# Altium schematic sheet PS_Ethernet.SchDoc: PS_Ethernet
size A3; Author: Carlos Barreiro; Organization: Escuela Técnica Superior de Ingeniería de Sistemas Informáticos de la Universidad Politécnica de Madrid; Address1: Campus Sur de la Universidad Politécnica de Madrid; Address2: Calle de Alan Turing, s/nº; Address3: Madrid 28031; Address4: España; DocumentNumber: 14; Revision: A; SheetNumber: 14; SheetTotal: 16
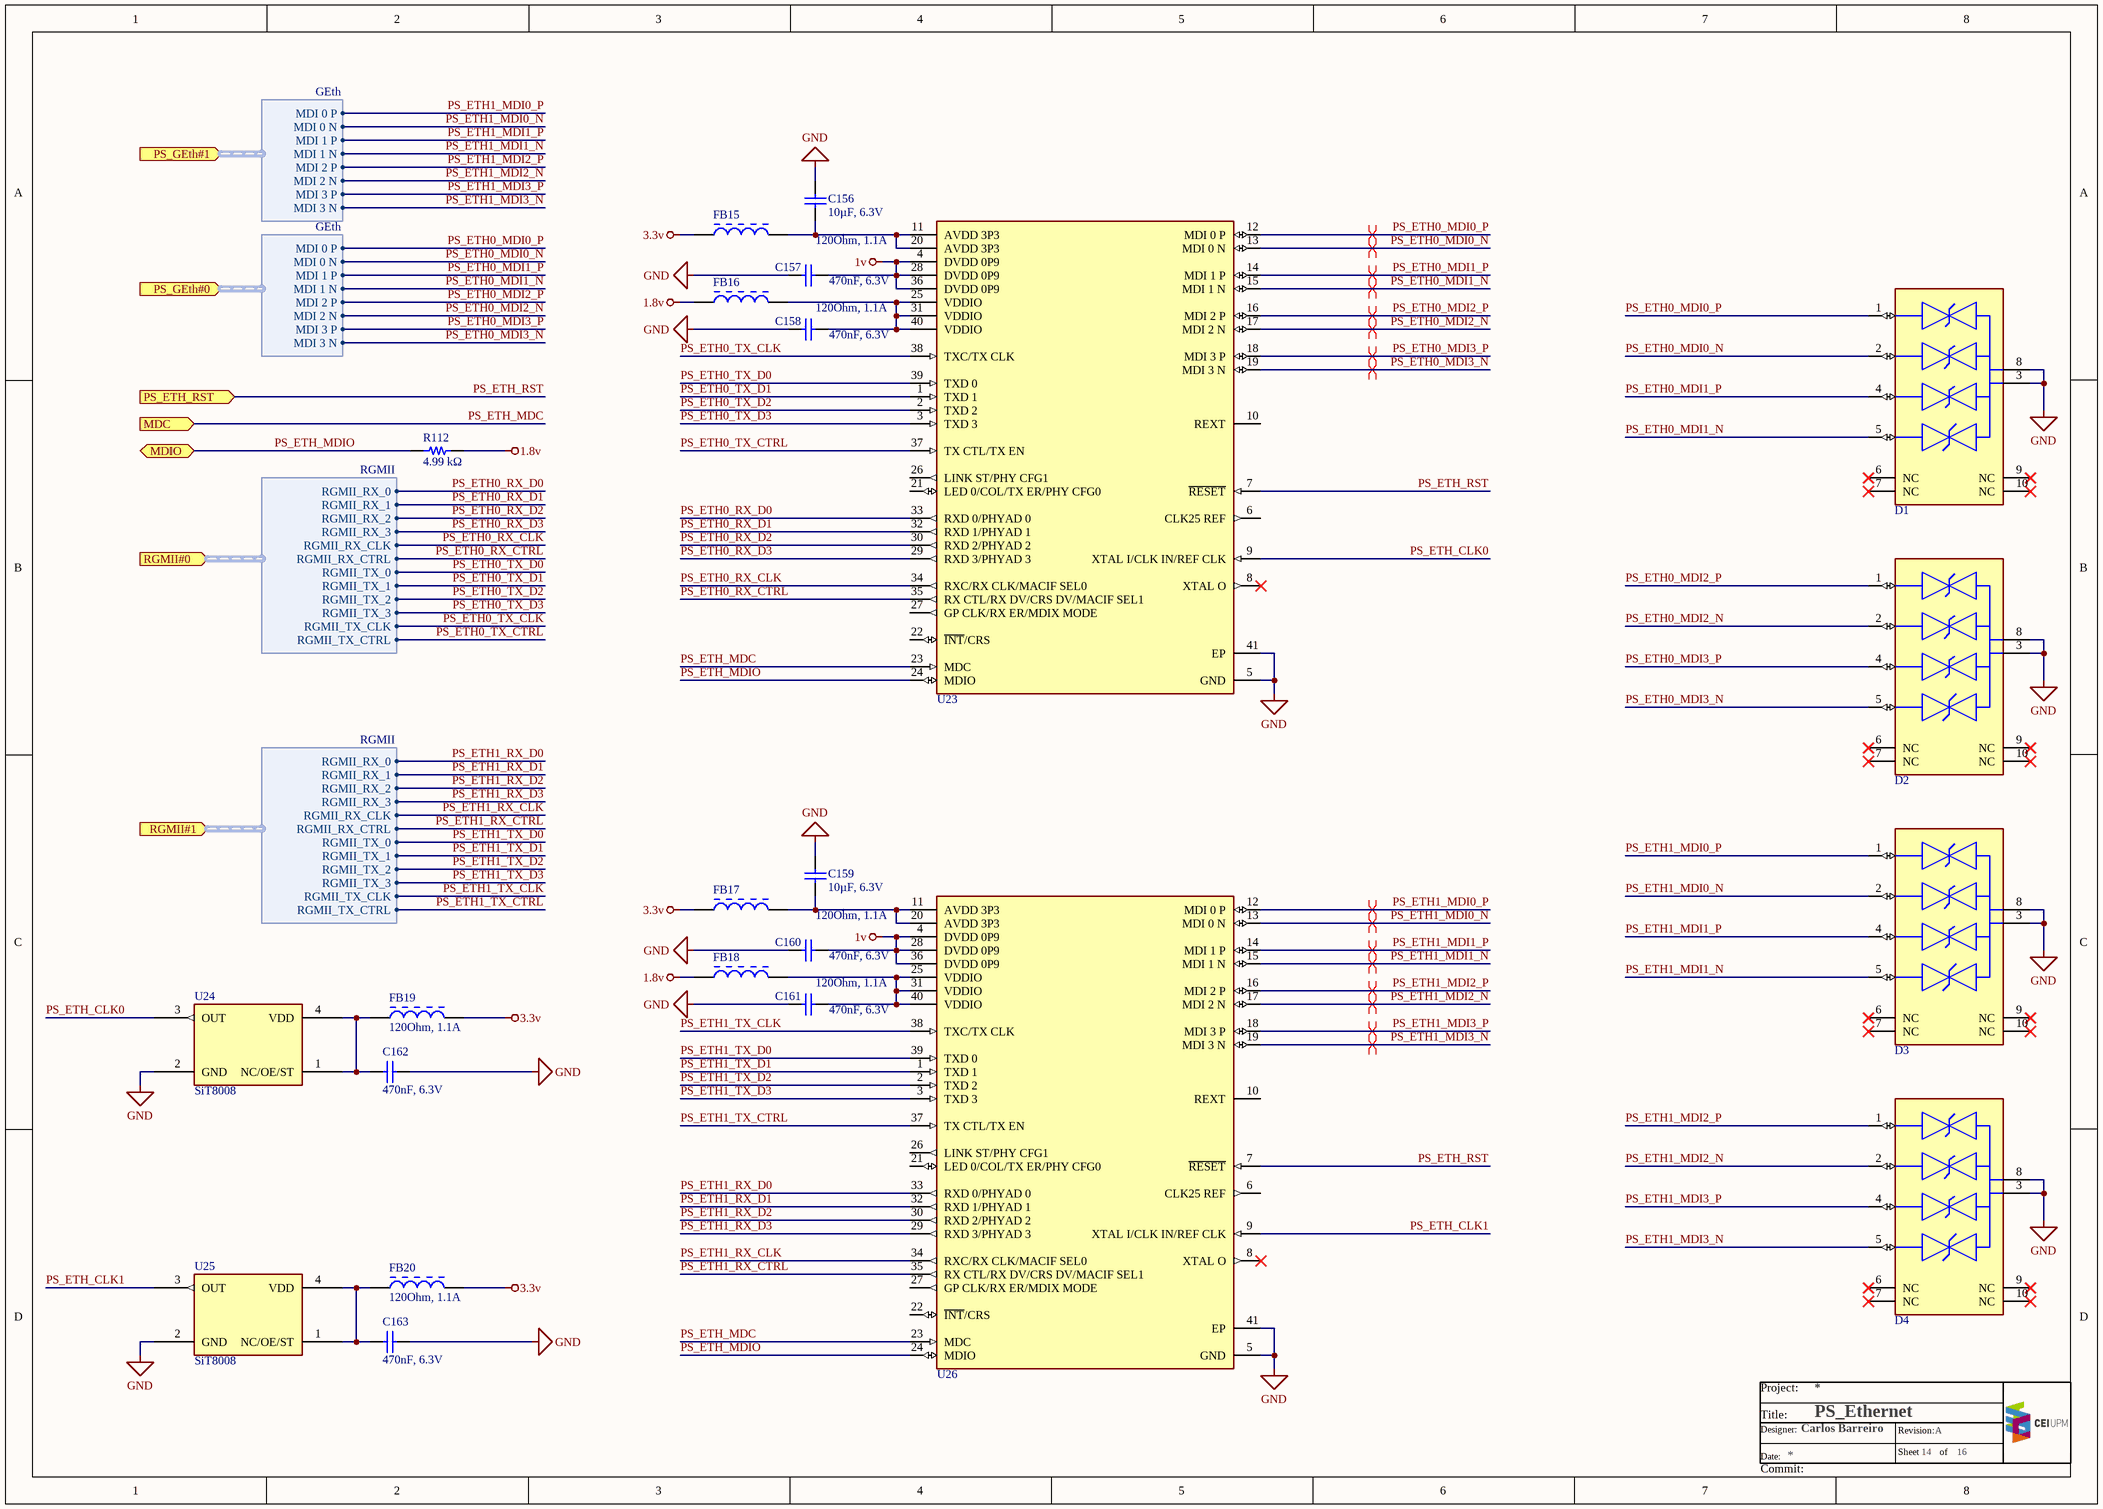
[diagram p0: PS_Ethernet.SchDoc]

## Parts
C156  10µF, 6.3V  [WURTH_WCAP-CSGP_0402]
C157  470nF, 6.3V  [WURTH_WCAP-CSGP_0402]
C158  470nF, 6.3V  [WURTH_WCAP-CSGP_0402]
C159  10µF, 6.3V  [WURTH_WCAP-CSGP_0402]
C160  470nF, 6.3V  [WURTH_WCAP-CSGP_0402]
C161  470nF, 6.3V  [WURTH_WCAP-CSGP_0402]
C162  470nF, 6.3V  [WURTH_WCAP-CSGP_0402]
C163  470nF, 6.3V  [WURTH_WCAP-CSGP_0402]
D1  ESD204DQAR  [TEXAS_USON10]  (value not drawn)
D2  ESD204DQAR  [TEXAS_USON10]  (value not drawn)
D3  ESD204DQAR  [TEXAS_USON10]  (value not drawn)
D4  ESD204DQAR  [TEXAS_USON10]  (value not drawn)
FB15  120Ohm, 1.1A  [WURTH-CBF_0402]
FB16  120Ohm, 1.1A  [WURTH-CBF_0402]
FB17  120Ohm, 1.1A  [WURTH-CBF_0402]
FB18  120Ohm, 1.1A  [WURTH-CBF_0402]
FB19  120Ohm, 1.1A  [WURTH-CBF_0402]
FB20  120Ohm, 1.1A  [WURTH-CBF_0402]
R112  4.99 kΩ  [PANASONIC_ERJ2G_0402]
U23  ADIN1300CCPZ  [ADI_LFCSP40]  (value not drawn)
U24  SiT8008  [SiTime_5032_4]
U25  SiT8008  [SiTime_5032_4]
U26  ADIN1300CCPZ  [ADI_LFCSP40]  (value not drawn)

## Ports
MDC (in), MDIO (bidir), PS_ETH_RST (in), PS_GEth#0 (in, harness GEth), PS_GEth#1 (in, harness GEth), RGMII#0 (in, harness RGMII), RGMII#1 (in, harness RGMII)

## Harnesses
RGMII: RGMII_RX_0, RGMII_RX_1, RGMII_RX_2, RGMII_RX_3, RGMII_RX_CLK, RGMII_RX_CTRL, RGMII_TX_0, RGMII_TX_1, RGMII_TX_2, RGMII_TX_3, RGMII_TX_CLK, RGMII_TX_CTRL
GEth: MDI 0 P, MDI 0 N, MDI 1 P, MDI 1 N, MDI 2 P, MDI 2 N, MDI 3 P, MDI 3 N

## Nets
1.8v: FB16.1 FB18.1 R112.2
1v: C157.2 C160.2 U23.4(DVDD_0P9) U23.28(DVDD_0P9) U23.36(DVDD_0P9) U26.4(DVDD_0P9) U26.28(DVDD_0P9) U26.36(DVDD_0P9)
3.3v: FB15.1 FB17.1 FB19.2 FB20.2
GND: C156.2 C157.1 C158.1 C159.2 C160.1 C161.1 C162.1 C163.1 D1.3(GND) D1.8(GND) D2.3(GND) D2.8(GND) D3.3(GND) D3.8(GND) D4.3(GND) D4.8(GND) U23.5(GND) U23.41(EP) U24.2(GND) U25.2(GND) U26.5(GND) U26.41(EP)
PS_ETH0_MDI0_N: D1.2(IO2) U23.13(MDI_0_N) ; port PS_GEth#0.MDI 0 N
PS_ETH0_MDI0_P: D1.1(IO1) U23.12(MDI_0_P) ; port PS_GEth#0.MDI 0 P
PS_ETH0_MDI1_N: D1.5(IO4) U23.15(MDI_1_N) ; port PS_GEth#0.MDI 1 N
PS_ETH0_MDI1_P: D1.4(IO3) U23.14(MDI_1_P) ; port PS_GEth#0.MDI 1 P
PS_ETH0_MDI2_N: D2.2(IO2) U23.17(MDI_2_N) ; port PS_GEth#0.MDI 2 N
PS_ETH0_MDI2_P: D2.1(IO1) U23.16(MDI_2_P) ; port PS_GEth#0.MDI 2 P
PS_ETH0_MDI3_N: D2.5(IO4) U23.19(MDI_3_N) ; port PS_GEth#0.MDI 3 N
PS_ETH0_MDI3_P: D2.4(IO3) U23.18(MDI_3_P) ; port PS_GEth#0.MDI 3 P
PS_ETH0_RX_CLK: U23.34(RXC/RX_CLK/MACIF_SEL0) ; port RGMII#0.RGMII_RX_CLK
PS_ETH0_RX_CTRL: U23.35(RX_CTL/RX_DV/CRS_DV/MACIF_SEL1) ; port RGMII#0.RGMII_RX_CTRL
PS_ETH0_RX_D0: U23.33(RXD_0/PHYAD_0) ; port RGMII#0.RGMII_RX_0
PS_ETH0_RX_D1: U23.32(RXD_1/PHYAD_1) ; port RGMII#0.RGMII_RX_1
PS_ETH0_RX_D2: U23.30(RXD_2/PHYAD_2) ; port RGMII#0.RGMII_RX_2
PS_ETH0_RX_D3: U23.29(RXD_3/PHYAD_3) ; port RGMII#0.RGMII_RX_3
PS_ETH0_TX_CLK: U23.38(TXC/TX_CLK) ; port RGMII#0.RGMII_TX_CLK
PS_ETH0_TX_CTRL: U23.37(TX_CTL/TX_EN) ; port RGMII#0.RGMII_TX_CTRL
PS_ETH0_TX_D0: U23.39(TXD_0) ; port RGMII#0.RGMII_TX_0
PS_ETH0_TX_D1: U23.1(TXD_1) ; port RGMII#0.RGMII_TX_1
PS_ETH0_TX_D2: U23.2(TXD_2) ; port RGMII#0.RGMII_TX_2
PS_ETH0_TX_D3: U23.3(TXD_3) ; port RGMII#0.RGMII_TX_3
PS_ETH1_MDI0_N: D3.2(IO2) U26.13(MDI_0_N) ; port PS_GEth#1.MDI 0 N
PS_ETH1_MDI0_P: D3.1(IO1) U26.12(MDI_0_P) ; port PS_GEth#1.MDI 0 P
PS_ETH1_MDI1_N: D3.5(IO4) U26.15(MDI_1_N) ; port PS_GEth#1.MDI 1 N
PS_ETH1_MDI1_P: D3.4(IO3) U26.14(MDI_1_P) ; port PS_GEth#1.MDI 1 P
PS_ETH1_MDI2_N: D4.2(IO2) U26.17(MDI_2_N) ; port PS_GEth#1.MDI 2 N
PS_ETH1_MDI2_P: D4.1(IO1) U26.16(MDI_2_P) ; port PS_GEth#1.MDI 2 P
PS_ETH1_MDI3_N: D4.5(IO4) U26.19(MDI_3_N) ; port PS_GEth#1.MDI 3 N
PS_ETH1_MDI3_P: D4.4(IO3) U26.18(MDI_3_P) ; port PS_GEth#1.MDI 3 P
PS_ETH1_RX_CLK: U26.34(RXC/RX_CLK/MACIF_SEL0) ; port RGMII#1.RGMII_RX_CLK
PS_ETH1_RX_CTRL: U26.35(RX_CTL/RX_DV/CRS_DV/MACIF_SEL1) ; port RGMII#1.RGMII_RX_CTRL
PS_ETH1_RX_D0: U26.33(RXD_0/PHYAD_0) ; port RGMII#1.RGMII_RX_0
PS_ETH1_RX_D1: U26.32(RXD_1/PHYAD_1) ; port RGMII#1.RGMII_RX_1
PS_ETH1_RX_D2: U26.30(RXD_2/PHYAD_2) ; port RGMII#1.RGMII_RX_2
PS_ETH1_RX_D3: U26.29(RXD_3/PHYAD_3) ; port RGMII#1.RGMII_RX_3
PS_ETH1_TX_CLK: U26.38(TXC/TX_CLK) ; port RGMII#1.RGMII_TX_CLK
PS_ETH1_TX_CTRL: U26.37(TX_CTL/TX_EN) ; port RGMII#1.RGMII_TX_CTRL
PS_ETH1_TX_D0: U26.39(TXD_0) ; port RGMII#1.RGMII_TX_0
PS_ETH1_TX_D1: U26.1(TXD_1) ; port RGMII#1.RGMII_TX_1
PS_ETH1_TX_D2: U26.2(TXD_2) ; port RGMII#1.RGMII_TX_2
PS_ETH1_TX_D3: U26.3(TXD_3) ; port RGMII#1.RGMII_TX_3
PS_ETH_CLK0: U23.9(XTAL_I/CLK_IN/REF_CLK) U24.3(OUT)
PS_ETH_CLK1: U25.3(OUT) U26.9(XTAL_I/CLK_IN/REF_CLK)
PS_ETH_MDC: U23.23(MDC) U26.23(MDC) ; port MDC
PS_ETH_MDIO: R112.1 U23.24(MDIO) U26.24(MDIO) ; port MDIO
PS_ETH_RST: U23.7(~{RESET}) U26.7(~{RESET}) ; port PS_ETH_RST
NetC156_1: C156.1 FB15.2 U23.11(AVDD_3P3) U23.20(AVDD_3P3)
NetC158_2: C158.2 FB16.2 U23.25(VDDIO) U23.31(VDDIO) U23.40(VDDIO)
NetC159_1: C159.1 FB17.2 U26.11(AVDD_3P3) U26.20(AVDD_3P3)
NetC161_2: C161.2 FB18.2 U26.25(VDDIO) U26.31(VDDIO) U26.40(VDDIO)
NetC162_2: C162.2 FB19.1 U24.1(NC/OE/ST) U24.4(VDD)
NetC163_2: C163.2 FB20.1 U25.1(NC/OE/ST) U25.4(VDD)

Not connected (* = marked no-connect by the designer): D1 6(NC)* 7(NC)* 9(NC)* 10(NC)*; D2 6(NC)* 7(NC)* 9(NC)* 10(NC)*; D3 6(NC)* 7(NC)* 9(NC)* 10(NC)*; D4 6(NC)* 7(NC)* 9(NC)* 10(NC)*; U23 6(CLK25_REF) 8(XTAL_O)* 10(REXT) 21(LED_0/COL/TX_ER/PHY_CFG0) 22(~{INT}/CRS) 26(LINK_ST/PHY_CFG1) 27(GP_CLK/RX_ER/MDIX_MODE); U26 6(CLK25_REF) 8(XTAL_O)* 10(REXT) 21(LED_0/COL/TX_ER/PHY_CFG0) 22(~{INT}/CRS) 26(LINK_ST/PHY_CFG1) 27(GP_CLK/RX_ER/MDIX_MODE)

## Layout directives
differential pair: PS_ETH0_MDI0_N, PS_ETH0_MDI0_P, PS_ETH0_MDI1_N, PS_ETH0_MDI1_P, PS_ETH0_MDI2_N, PS_ETH0_MDI2_P, PS_ETH0_MDI3_N, PS_ETH0_MDI3_P, PS_ETH1_MDI0_N, PS_ETH1_MDI0_P, PS_ETH1_MDI1_N, PS_ETH1_MDI1_P, PS_ETH1_MDI2_N, PS_ETH1_MDI2_P, PS_ETH1_MDI3_N, PS_ETH1_MDI3_P

## Notes on the sheet
- Project:
- Title:
- Date:
- Designer:
- Sheet
- Revision:
- of
- Commit:

## Library data of the parts
C156 C159 = 885012105020: WCAP-CSGP Multilayer Ceramic Chip Capacitor, General Purpose, size 0402, X5R, 10uF, 6.3V; Manufacturer: Wurth Elektronik; Rated Voltage: 6.3VDC; Isolation Resistance  min.: 0.01GOhm; Capacitance Tolerance: +/20%; Dissipation Factor max.: 10%; Technical Reference: X5R0402106M6R3DFCT10000; ComponentLink1Description: Manufacturer; ComponentLink1URL: http://www.we-online.de; ComponentLink2Description: Datasheet; ComponentLink2URL: https://www.we-online.com/catalog/datasheet/885012105020.pdf; Operating Temperature: -55 to +85degC; Packaging: Tape and Reel; Manufacturer Part Number: 885012105020; Published Date: April 2021; Ceramic Type: X5R; Height: 0.5mm; Mounting Technology: SMT; Size: 0402; Capacitance: 10uF; Q-Factor min.: -
C157 C158 C160-C163 = 885012105004: WCAP-CSGP Multilayer Ceramic Chip Capacitor, General Purpose, size 0402, X5R, 470nF, 6.3V; Manufacturer: Wurth Elektronik; Rated Voltage: 6.3VDC; Isolation Resistance  min.: 0.2GOhm; Capacitance Tolerance: +/-20%; Dissipation Factor max.: 10%; Technical Reference: X5R0402474M6R3DFCT10000; ComponentLink1Description: Manufacturer; ComponentLink1URL: http://www.we-online.de; ComponentLink2Description: Datasheet; ComponentLink2URL: https://www.we-online.com/catalog/datasheet/885012105004.pdf; Operating Temperature: -55 to +85degC; Packaging: Tape and Reel; Manufacturer Part Number: 885012105004; Published Date: April 2021; Ceramic Type: X5R; Height: 0.5mm; Mounting Technology: SMT; Size: 0402; Capacitance: 470nF; Supplier 1: Digi-Key; Supplier 2: Mouser; Supplier Part Number 1: 732-7481-1-ND; Supplier Part Number 2: 710-885012105004
D1-D4 = ESD204DQAR: ESD204 4-Channel Low-Capacitance Surge and ESD Protection Diode; Number of channels (#): 4; IO capacitance (Typ) (pF): 0.55; Vrwm (V): 3.6; Bi-/uni-directional: Bi-Directional; IO leakage current (Max) (nA): 10; Rating: Catalog; Dynamic resistance (Typ) (Ω): 0.3; Clamping voltage (V): 11.5; Operating temperature range (C): -40ºC to 125ºC; ComponentLink1Description: Manufacturer; ComponentLink1URL: https://www.ti.com/product/ESD204; Supplier 1: Digi-Key; Supplier 2: Mouser; Supplier Part Number 1: 296-49504-1-ND; Supplier Part Number 2: 595-ESD204DQAR
FB15-FB20 = 74279271: WE-CBF SMT EMI Suppression Ferrite Bead, size 0402, 120Ohm, 1.1A; Manufacturer: Wurth Elektronik; Impedance max.: 200Ohm; DC Resistance max.: 0.2Ohm; Type: Wide Band; ComponentLink1Description: Manufacturer; ComponentLink1URL: http://www.we-online.de; ComponentLink2Description: Datasheet; ComponentLink2URL: https://www.we-online.com/catalog/datasheet/74279271.pdf; Operating Temperature: -55 to +125degC; Packaging: Tape and Reel; Published Date: December 2021; Rated Current: 1.1A; Manufacturer Part Number: 74279271; Impedance @100MHz: 120Ohm; Mounting Technology: SMT; Size: 0402; Height: 0.5mm; Length: 1mm; Width: 0.5mm
R112 = ERJ2RKF4991X: General Purpose Thick Film Chip Resistors; Manufacturer: Panasonic; Power (0402): 0.1 W; Limiting Voltage (0402): 50; Maximum Voltage (0402): 100; Resistance Range (Ω): 1Ω to 100MΩ; AEC 200: Grade 0; Size (0402): 2GE; ComponentLink1Description: Catalog; ComponentLink1URL: https://industrial.panasonic.com/ww/products/pt/general-purpose-chip-resistors/models?op=search&model_status_current=1&page=0#model-list-search-results; Series: ERJ; Temperature Range (ºC): -55 to +155; Supplier 1: Digi-Key; Supplier Part Number 1: P4.99KLTR-ND
U23 U26 = ADIN1300CCPZ: Robust, Industrial, Low Latency and Low Power 10 Mbps, 100 Mbps, and 1 Gbps Ethernet PHY; MAC Interface: MII, RMII, RGMII; Package: 40-lead, 6 mm × 6 mm LFCSP; Operating Temperature: −40°C to +105°C; ComponentLink1Description: Manufacturer; ComponentLink1URL: https://www.analog.com/en/products/adin1300.html#product-tools; ComponentLink2Description: Application Note; ComponentLink2URL: https://wiki.analog.com/resources/eval/user-guides/adin1300-and-adin1200/cap-coupling#:~:text=The%20ADIN1300%20and%20ADIN1200%20are,10%2F100%20Mbps%20Ethernet%20speeds.; Supplier 1: Digi-Key; Supplier 2: Mouser; Supplier Part Number 2: 584-ADIN1300CCPZ; Supplier Part Number 1: 505-ADIN1300CCPZ-ND
U24 U25 = SiT8008: Programmable oscillator, featuring wide frequency range, low power consumption, small size and excellent stability.; Frequency: 1 to 110 MHz; Frequency Stability (ppm): ±20, ±25, ±50; Phase Jitter (rms): 1.3 ps; Output Type: LVCMOS; Voltage Supply (V): 1.8V to 3.3V; Package Type (mm²): 5.0x3.2; Operating Temperature Range (°C): -40ºC to +85ºC; ComponentLink1Description: Manufacturer; ComponentLink1URL: https://www.sitime.com/products/lvcmos-oscillators/sit8008; Supplier 1: Mouser; Supplier Part Number 1: 788-8008BI2333S1000G